# Altium schematic sheet Smart Humidifier.SchDoc
size A2
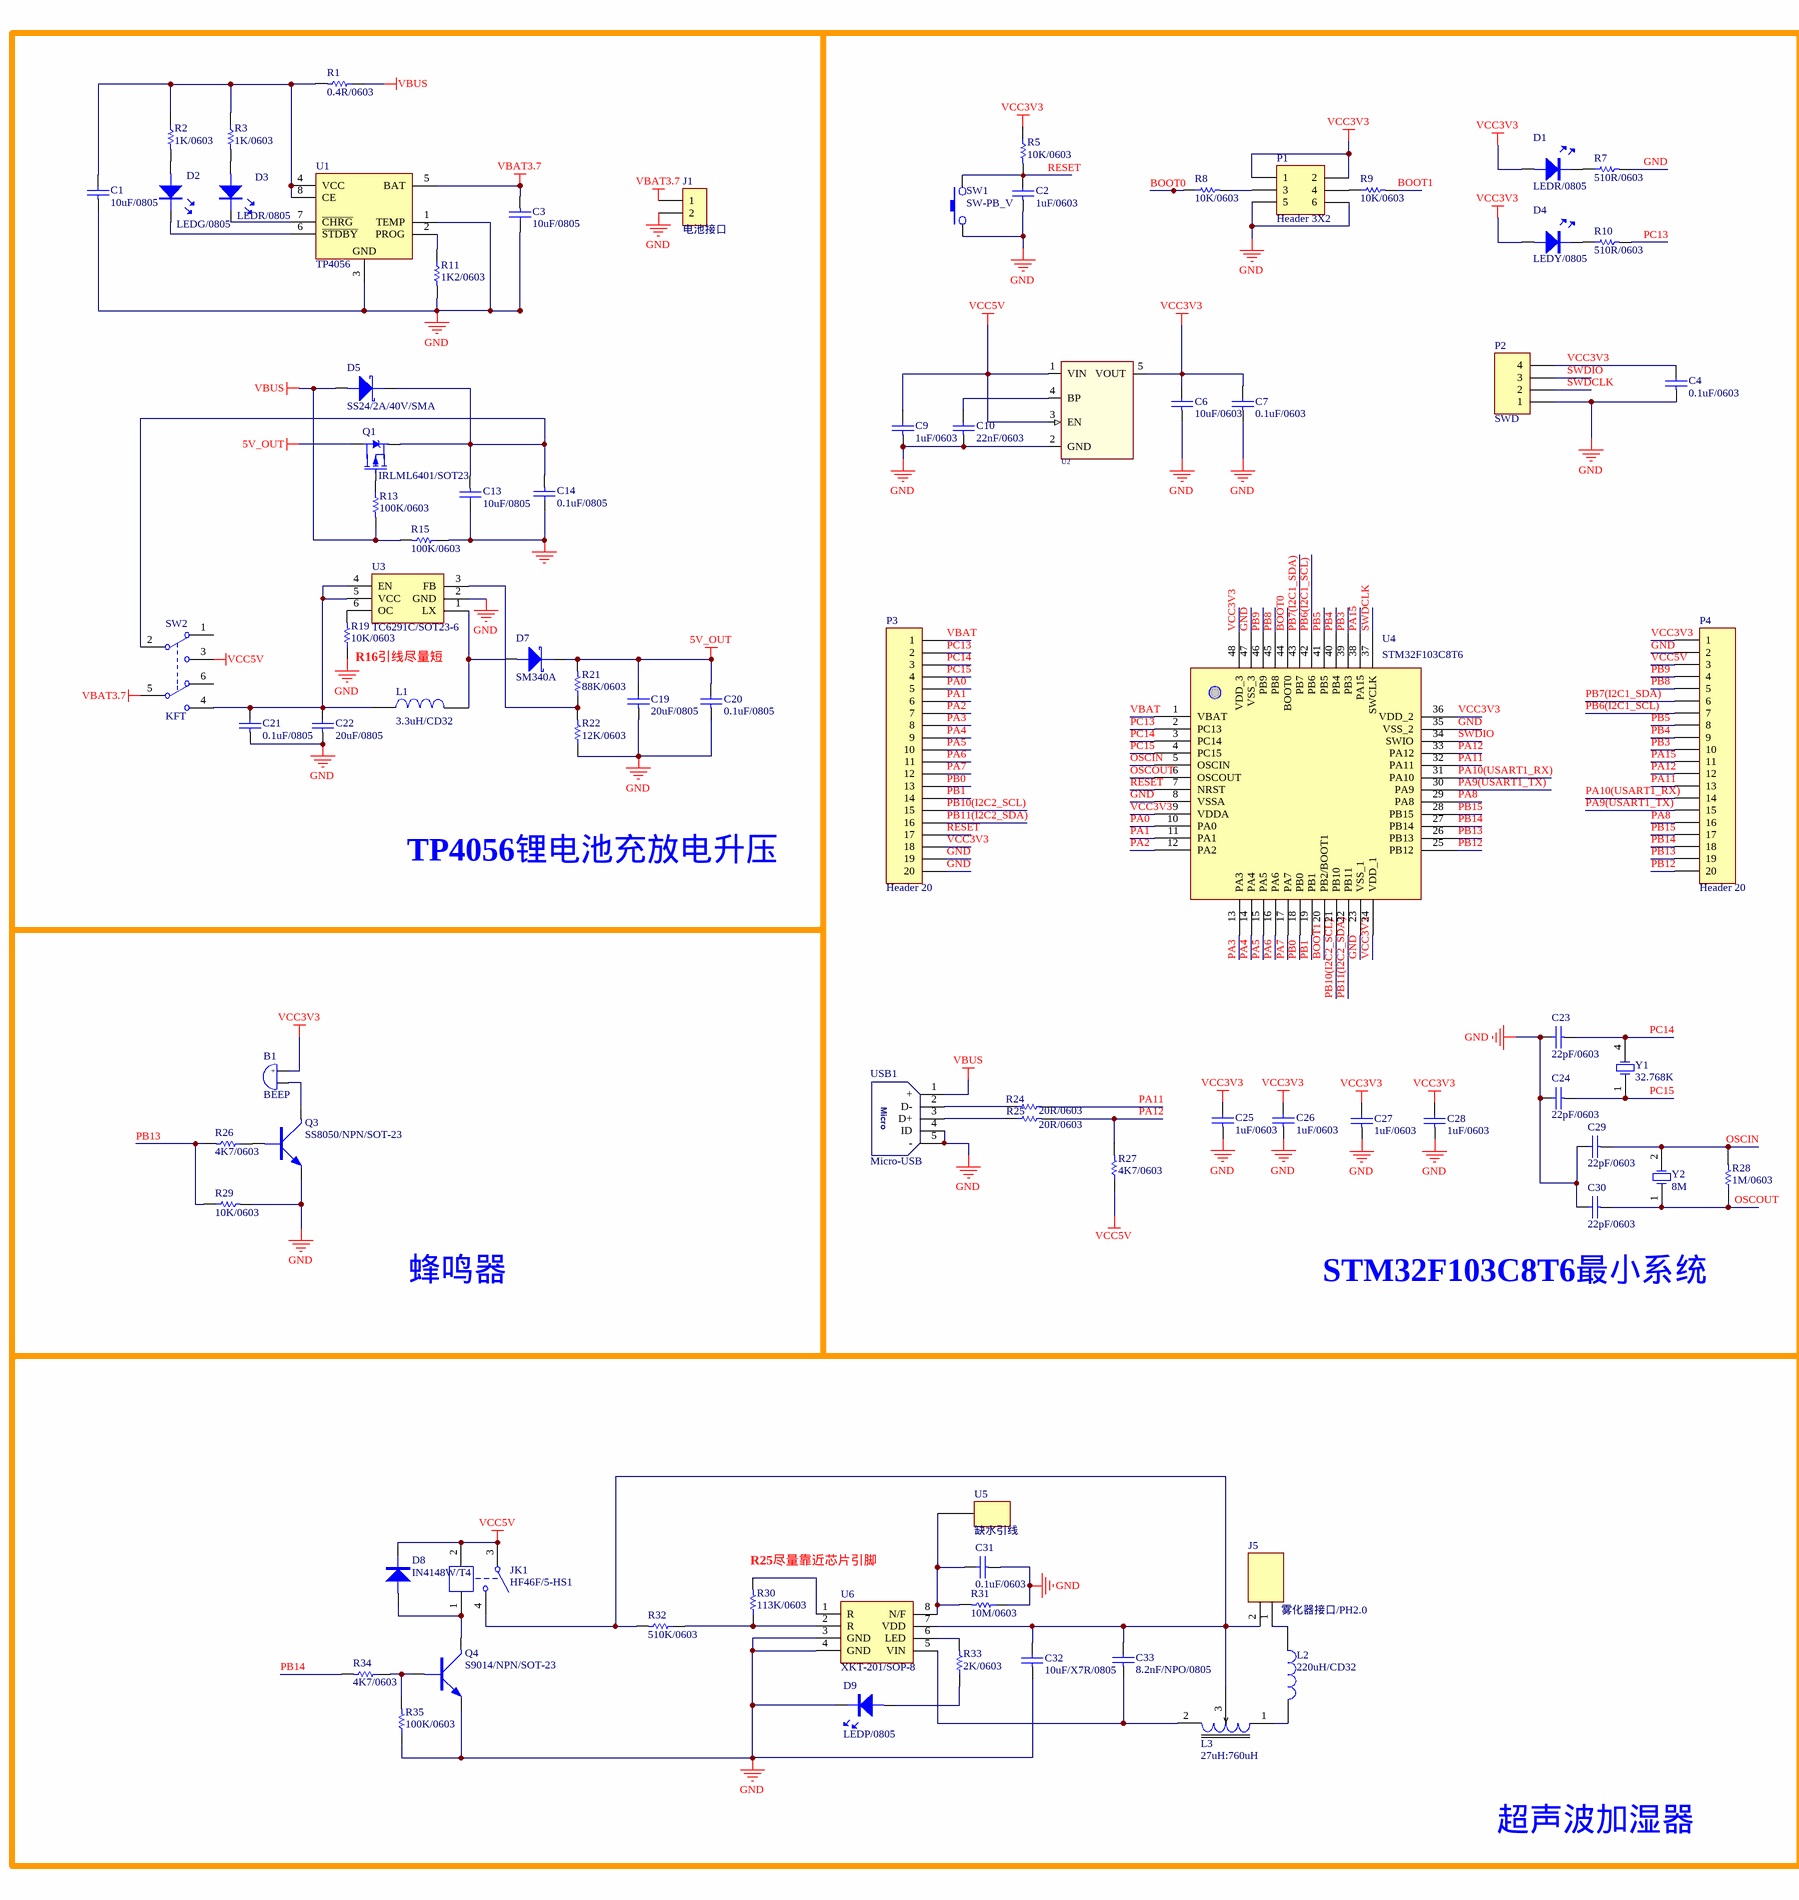
[diagram p0: Smart Humidifier.SchDoc, left]
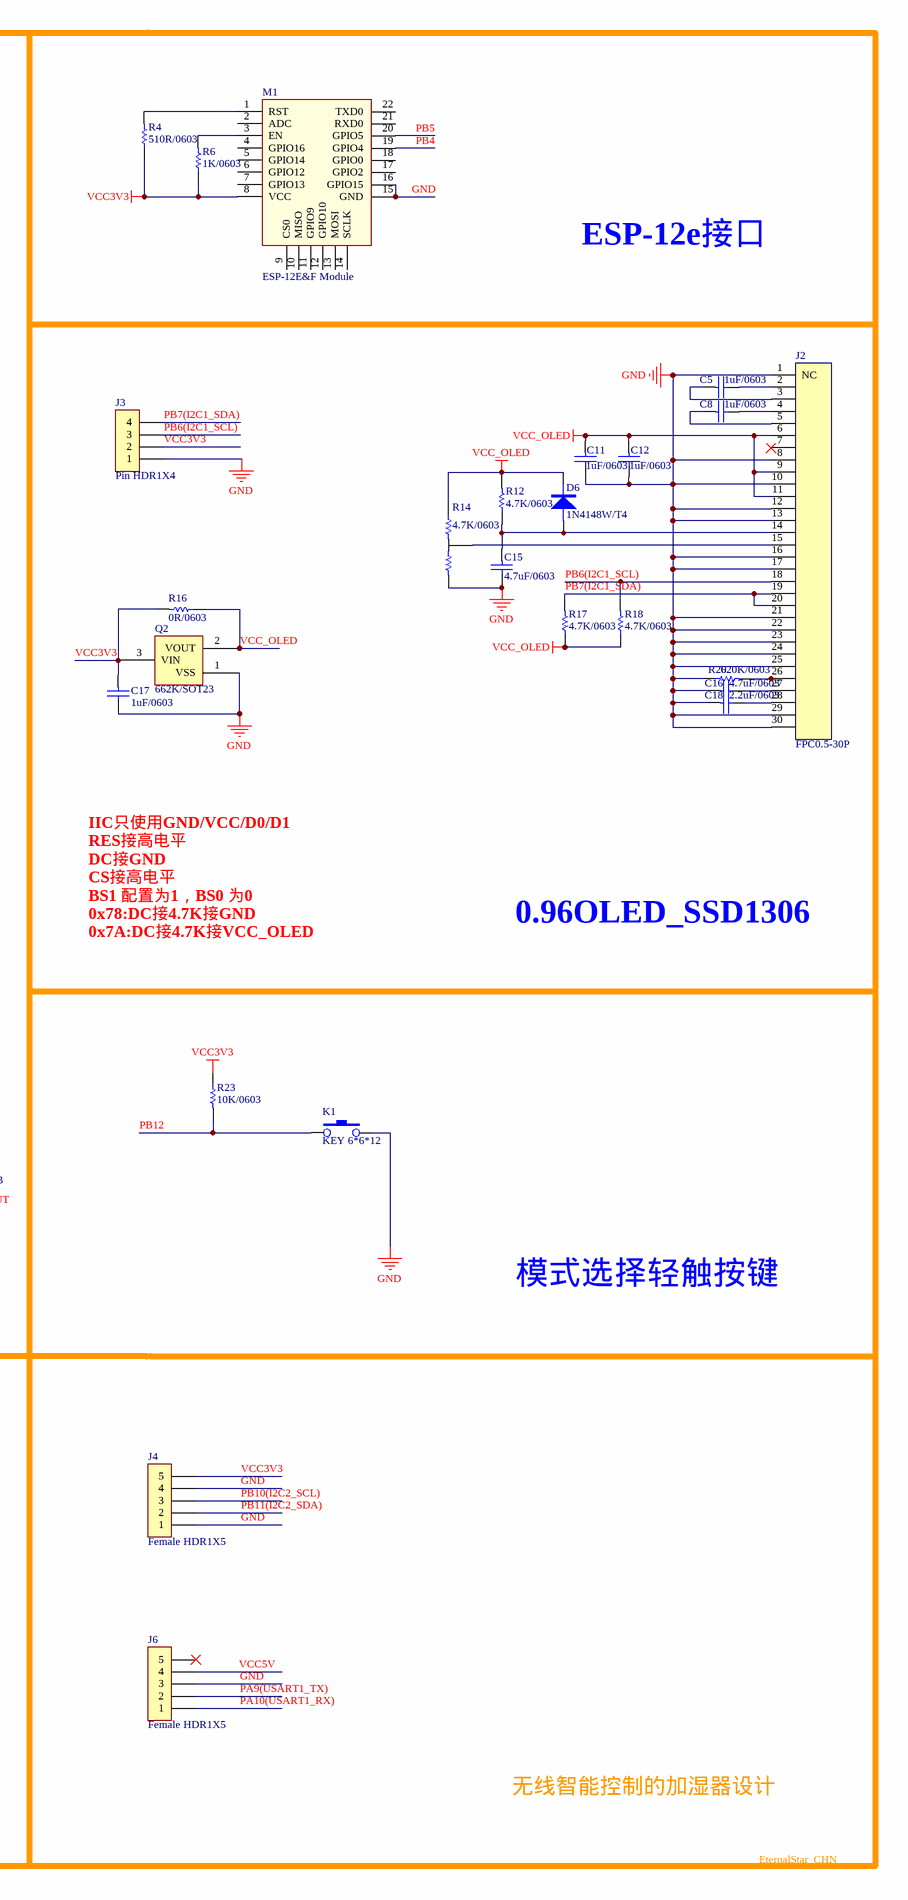
[diagram p1: Smart Humidifier.SchDoc, right]

## Parts
B1  BEEP  [BEEP 5x9x5.5]
C1  10uF/0805  [0805C]
C2  1uF/0603  [0603C]
C3  10uF/0805  [0805C]
C4  0.1uF/0603  [0603C]
C5  1uF/0603  [0603C]
C6  10uF/0603  [0603C]
C7  0.1uF/0603  [0603C]
C8  1uF/0603  [0603C]
C9  1uF/0603  [0603C]
C10  22nF/0603  [0603C]
C11  1uF/0603  [0603C]
C12  1uF/0603  [0603C]
C13  10uF/0805  [0805C]
C14  0.1uF/0805  [0805C]
C15  4.7uF/0603  [0603C]
C16  4.7uF/0603  [0603C]
C17  1uF/0603  [0603C]
C18  2.2uF/0603  [0603C]
C19  20uF/0805  [0805C]
C20  0.1uF/0805  [0805C]
C21  0.1uF/0805  [0805C]
C22  20uF/0805  [0805C]
C23  22pF/0603  [0603C]
C24  22pF/0603  [0603C]
C25  1uF/0603  [0603C]
C26  1uF/0603  [0603C]
C27  1uF/0603  [0603C]
C28  1uF/0603  [0603C]
C29  22pF/0603  [0603C]
C30  22pF/0603  [0603C]
C31  0.1uF/0603  [0603C]
C32  10uF/X7R/0805  [0805C]
C33  8.2nF/NPO/0805  [0805C]
D1  LEDR/0805  [LED-0805R]
D2  LEDG/0805  [LED-0805G]
D3  LEDR/0805  [LED-0805R]
D4  LEDY/0805  [LED-0805Y]
D5  SS24/2A/40V/SMA  [SMA/DO-214AC]
D6  1N4148W/T4  [SOD-123]
D7  SM340A  [SMA/DO-214AC]
D8  IN4148W/T4  [SOD-123]
D9  LEDP/0805  [LED-0805Y]
J1  电池接口  [Fe-HDR1X2/2.54-S]
J2  FPC0.5-30P  [FPC0.5-30P]
J3  Pin HDR1X4  [Pin HDR1X4/2.54mm-S]
J4  Female HDR1X5  [Fe-HDR1X5/2.54-S]
J5  雾化器接口/PH2.0  [PH2.0-2P]
J6  Female HDR1X5  [Fe-HDR1X5/2.54-S]
JK1  HF46F/5-HS1  [HF46-xx-HS1]
K1  KEY 6*6*12  [DIP-6X6X12_C]
L1  3.3uH/CD32  [CD32]
L2  220uH/CD32  [CD32]
L3  27uH:760uH  [INDUCTOR Tripod]
M1  ESP-12E&F Module  [ESP-12E&F Module]
P1  Header 3X2  [HDR-3X2]
P2  SWD  [HDR-1X4_H]
P3  Header 20  [HDR1X20]
P4  Header 20  [HDR1X20]
Q1  IRLML6401/SOT23  [SOT23]
Q2  662K/SOT23  [SOT23]
Q3  SS8050/NPN/SOT-23  [SOT-23]
Q4  S9014/NPN/SOT-23  [SOT-23]
R1  0.4R/0603  [0603R]
R2  1K/0603  [0603R]
R3  1K/0603  [0603R]
R4  510R/0603  [0603R]
R5  10K/0603  [0603R]
R6  1K/0603  [0603R]
R7  510R/0603  [0603R]
R8  10K/0603  [0603R]
R9  10K/0603  [0603R]
R10  510R/0603  [0603R]
R11  1K2/0603  [0603R]
R12  4.7K/0603  [0603R]
R13  100K/0603  [0603R]
R14  4.7K/0603  [SW_0603R]
R15  100K/0603  [0603R]
R16  0R/0603  [0603R]
R17  4.7K/0603  [0603R]
R18  4.7K/0603  [0603R]
R19  10K/0603  [0603R]
R20  620K/0603  [0603R]
R21  88K/0603  [0603R]
R22  12K/0603  [0603R]
R23  10K/0603  [0603R]
R24  20R/0603  [0603R]
R25  20R/0603  [0603R]
R26  4K7/0603  [0603R]
R27  4K7/0603  [0603R]
R28  1M/0603  [0603R]
R29  10K/0603  [0603R]
R30  113K/0603  [0603R]
R31  10M/0603  [0603R]
R32  510K/0603  [0603R]
R33  2K/0603  [0603R]
R34  4K7/0603  [0603R]
R35  100K/0603  [0603R]
SW1  SW-PB_V  [TSW SMD-3*6*2.5]
SW2  KFT  [KFT DIP-7X7]
U1  TP4056  [SOP8]
U2  RT9193  [SOT23-5L]  (value not drawn)
U3  TC6291C/SOT23-6  [SOT23-6]
U4  STM32F103C8T6  [TQFP48 7x7_L]
U5  缺水引线  [通孔焊盘]
U6  XKT-201/SOP-8  [SOP8]
USB1  Micro-USB  [USB-micro_B]
Y1  32.768K  [MC-306]
Y2  8M  [XTAL-49S DIP]

## Nets
5V_OUT: C19.2 C20.2 D7.K Q1.D R21.2
GND: C1.1 C2.1 C3.2 C4.1 C6.1 C7.1 C9.1 C10.1 C11.2 C12.2 C13.2 C14.2 C15.2 C16.1 C17.2 C18.1 C19.1 C20.1 C21.1 C22.1 C23.2 C24.2 C25.1 C26.1 C27.1 C28.1 C29.2 C30.2 C31.2 C32.1 D9.K J1.2 J2.1(NC) J2.8(VSS) J2.10(BS0) J2.12(NC) J2.13(CS) J2.16(E/RD) J2.17(R/W) J2.21(D3) J2.22(D4) J2.23(D5) J2.24(D6) J2.25(D7) J2.29(VLSS) J2.30(NC) J3.1 J4.1 J4.4 J6.3 K1.3 M1.15(GND) M1.16(GPIO15) P1.5 P1.6 P2.1 P3.19 P3.20 P4.2 Q2.1(VSS) Q3.E Q4.E R7.2 R11.2 R14.3 R15.1 R19.1 R20.1 R22.1 R29.2 R31.1 R35.1 SW1.1 U1.1(TEMP) U1.3(GND) U2.2(GND) U3.2(GND) U4.8(VSSA) U4.23(VSS_1) U4.35(VSS_2) U4.47(VSS_3) U6.3(GND) U6.4(GND) USB1.4(ID) USB1.5(-)
VBAT3.7: C3.1 J1.1 SW2.5(COM2) U1.5(BAT)
VBUS: D5.A R1.1 R13.2 R15.2 USB1.1(+)
VCC3V3: B1.1 C4.2 C6.2 C7.2 C17.1 C25.2 C26.2 C27.2 C28.2 D1.A D4.A J3.2 J4.5 M1.8(VCC) P1.1 P1.2 P2.4 P3.18 P4.1 Q2.3(VIN) R4.1 R5.1 R6.1 R16.2 R23.1 U2.5(VOUT) U4.9(VDDA) U4.24(VDD_1) U4.36(VDD_2) U4.48(VDD_3)
VCC5V: C9.2 D8.K J6.4 JK1.2 JK1.3 P4.3 R27.1 SW2.3(NO1) U2.1(VIN) U2.3(EN)
VCC_OLED: C11.1 C12.1 D6.K J2.6(VBAT) J2.9(VDD) J2.11(BS1) Q2.2(VOUT) R12.2 R14.1 R16.1 R17.1 R18.1
BOOT0: R8.1 U4.44(BOOT0)
BOOT1: R9.2 U4.20(PB2/BOOT1)
OSCIN: C29.1 R28.2 U4.5(OSCIN) Y2.2(OSC2)
OSCOUT: C30.1 R28.1 U4.6(OSCOUT) Y2.1(OSC1)
PA0: P3.5 U4.10(PA0)
PA1: P3.6 U4.11(PA1)
PA2: P3.7 U4.12(PA2)
PA3: P3.8 U4.13(PA3)
PA4: P3.9 U4.14(PA4)
PA5: P3.10 U4.15(PA5)
PA6: P3.11 U4.16(PA6)
PA7: P3.12 U4.17(PA7)
PA8: P4.16 U4.29(PA8)
PA9(USART1_TX): J6.2 P4.15 U4.30(PA9)
PA10(USART1_RX): J6.1 P4.14 U4.31(PA10)
PA11: P4.13 R24.2 U4.32(PA11)
PA12: P4.12 R25.2 R27.2 U4.33(PA12)
PA15: P4.11 U4.38(PA15)
PB0: P3.13 U4.18(PB0)
PB1: P3.14 U4.19(PB1)
PB3: P4.10 U4.39(PB3)
PB4: M1.19(GPIO4) P4.9 U4.40(PB4)
PB5: M1.20(GPIO5) P4.8 U4.41(PB5)
PB6(I2C1_SCL): J2.18(D0) J3.3 P4.7 R18.2 U4.42(PB6)
PB7(I2C1_SDA): J2.19(D1) J2.20(D2) J3.4 P4.6 R17.2 U4.43(PB7)
PB8: P4.5 U4.45(PB8)
PB9: P4.4 U4.46(PB9)
PB10(I2C2_SCL): J4.3 P3.15 U4.21(PB10)
PB11(I2C2_SDA): J4.2 P3.16 U4.22(PB11)
PB12: K1.1 P4.20 R23.2 U4.25(PB12)
PB13: P4.19 R26.2 R29.1 U4.26(PB13)
PB14: P4.18 R34.2 U4.27(PB14)
PB15: P4.17 U4.28(PB15)
PC13: P3.2 R10.2 U4.2(PC13)
PC14: C23.1 P3.3 U4.3(PC14) Y1.4(OSC2)
PC15: C24.1 P3.4 U4.4(PC15) Y1.1(OSC1)
RESET: C2.2 P3.17 R5.2 SW1.2 U4.7(NRST)
SWDCLK: P2.2 U4.37(SWCLK)
SWDIO: P2.3 U4.34(SWIO)
VBAT: P3.1 U4.1(VBAT)
NetB1_2: B1.2 Q3.C
NetC1_2: C1.2 R1.2 R2.1 R3.1 U1.4(VCC) U1.8(CE)
NetC5_1: C5.1 J2.3(C2N)
NetC5_2: C5.2 J2.2(C2P)
NetC8_1: C8.1 J2.5(C1N)
NetC8_2: C8.2 J2.4(C1P)
NetC10_2: C10.2 U2.4(BP)
NetC13_1: C13.1 C14.1 D5.K Q1.S SW2.2(COM2)
NetC15_1: C15.1 D6.A J2.14(RES) R12.1
NetC16_2: C16.2 J2.27(VCCMH)
NetC18_2: C18.2 J2.28(VCC)
NetC21_2: C21.2 C22.2 L1.1 SW2.4(NO2) U3.4(EN) U3.5(VCC)
NetC31_1: C31.1 R31.2 U5.Hole(Con) U6.8(N/F)
NetC32_2: C32.2 C33.2 J5.2 JK1.4 L3.3 R32.2 U6.7(VDD)
NetC33_1: C33.1 L3.2 U6.5(VIN)
NetD1_K: D1.K R7.1
NetD2_A: D2.A R2.2
NetD2_K: D2.K U1.6(~{STDBY})
NetD3_A: D3.A R3.2
NetD3_K: D3.K U1.7(~{CHRG})
NetD4_K: D4.K R10.1
NetD7_A: D7.A L1.2 U3.1(LX)
NetD8_A: D8.A JK1.1 Q4.C
NetD9_A: D9.A R33.1
NetJ2_15: J2.15(DC) R14.2
NetJ2_26: J2.26(IREF) R20.2
NetJ5_1: J5.1 L2.1
NetL2_2: L2.2 L3.1
NetM1_1: M1.1(RST) R4.2
NetM1_3: M1.3(EN) R6.2
NetP1_3: P1.3 R8.2
NetP1_4: P1.4 R9.1
NetQ1_G: Q1.G R13.1
NetQ3_B: Q3.B R26.1
NetQ4_B: Q4.B R34.1 R35.2
NetR11_1: R11.1 U1.2(PROG)
NetR19_2: R19.2 U3.6(OC)
NetR21_1: R21.1 R22.2 U3.3(FB)
NetR24_1: R24.1 USB1.2(D-)
NetR25_1: R25.1 USB1.3(D+)
NetR30_1: R30.1 R32.1 U6.2(R)
NetR30_2: R30.2 U6.1(R)
NetR33_2: R33.2 U6.6(LED)

Not connected (* = marked no-connect by the designer): J2 7(NC)*; J6 5*; M1 2(ADC) 4(GPIO16) 5(GPIO14) 6(GPIO12) 7(GPIO13) 9(CS0) 10(MISO) 11(GPIO9) 12(GPIO10) 13(MOSI) 14(SCLK) 17(GPIO2) 18(GPIO0) 21(RXD0) 22(TXD0); SW2 1(NC1) 6(NC2)

## Notes on the sheet
- ESP-12e接口
- (near R19) R16引线尽量短
- TP4056锂电池充放电升压
- IIC只使用GND/VCC/D0/D1
  RES接高电平
  DC接GND
  CS接高电平
  BS1 配置为1，BS0 为0
  0x78:DC接4.7K接GND
  0x7A:DC接4.7K接VCC_OLED
- 0.96OLED_SSD1306
- 蜂鸣器
- (near C30) STM32F103C8T6最小系统
- 模式选择轻触按键
- (near R30) R25尽量靠近芯片引脚
- 无线智能控制的加湿器设计
- 超声波加湿器
- EternalStar_CHN
- (in symbol BEEP) +
- (in symbol Micro-USB) Micro

## Library data of the parts
B1 = BEEP: 蜂鸣器
C1-C33 = CAP: 无极性电容
D1-D4 D9 = LED
D5 D7 = DIODE SCHOTTKY: 肖特基二极管
D6 D8 = DIODE: 普通二极管
J1 = Female HDR1X2
J2 = FPC0.5-30P: 贴片; pin to pad: 1>30 2>29 3>28 4>27 5>26 6>25 7>24 8>23 9>22 10>21 11>20 12>19 13>18 14>17 15>16 16>15 17>14 18>13 19>12 20>11 21>10 22>9 23>8 24>7 25>6 26>5 27>4 28>3 29>2 30>1
J5 = PH2.0-2P
JK1 = HF46F/5-HS1: 5V一组常开; BOM名称: 5V继电器; 版权归属: 源创客; 学习资源: www.ooocke.com
K1 = KEY
L1 L2 = INDUCTOR
L3 = INDUCTOR Tripod: 三脚工字形电感线圈直插式
P1 = Header 3X2: Header, 3-Pin, Dual row; LatestRevisionDate: 17-Jul-2002; LatestRevisionNote: Re-released for DXP Platform.; Publisher: Altium Limited
P2 = Header 4: Header, 4-Pin; LatestRevisionDate: 17-Jul-2002; LatestRevisionNote: Re-released for DXP Platform.; Publisher: Altium Limited
P3 P4 = Header 20: Header, 20-Pin; LatestRevisionDate: 17-Jul-2002; LatestRevisionNote: Re-released for DXP Platform.; Publisher: Altium Limited
Q1 = P-MOS: P沟道场效应管
Q2 = LDO_SOT23: SOT23封装LDO
Q3 Q4 = NPN: NPN三极管
R1-R13 R15-R35 = RES
R14 = RES_SW
SW1 = SW-PB_V: SWITCH
SW2 = KFT_7X7-DIP: Self-locking Switch
U2 = RT9193X_5P: ICA_MFR_NAME: RICHTEK; ICA_PARTNUM: $$2191094$$RT9193-15CU5; Part Number: TMP-13
U3 = TC6291C: DC-DC升压IC
U5 = 过孔焊盘
U6 = XKT-201: 5V加湿器驱动芯片
Y1 Y2 = XTAL: Crystal Oscillator; Published: 8-Jun-2000; LatestRevisionDate: 17-Jul-2002; LatestRevisionNote: Re-released for DXP Platform.; Publisher: Altium Limited